# EAGLE design module-pre-amp (EAGLE 7.4.0)
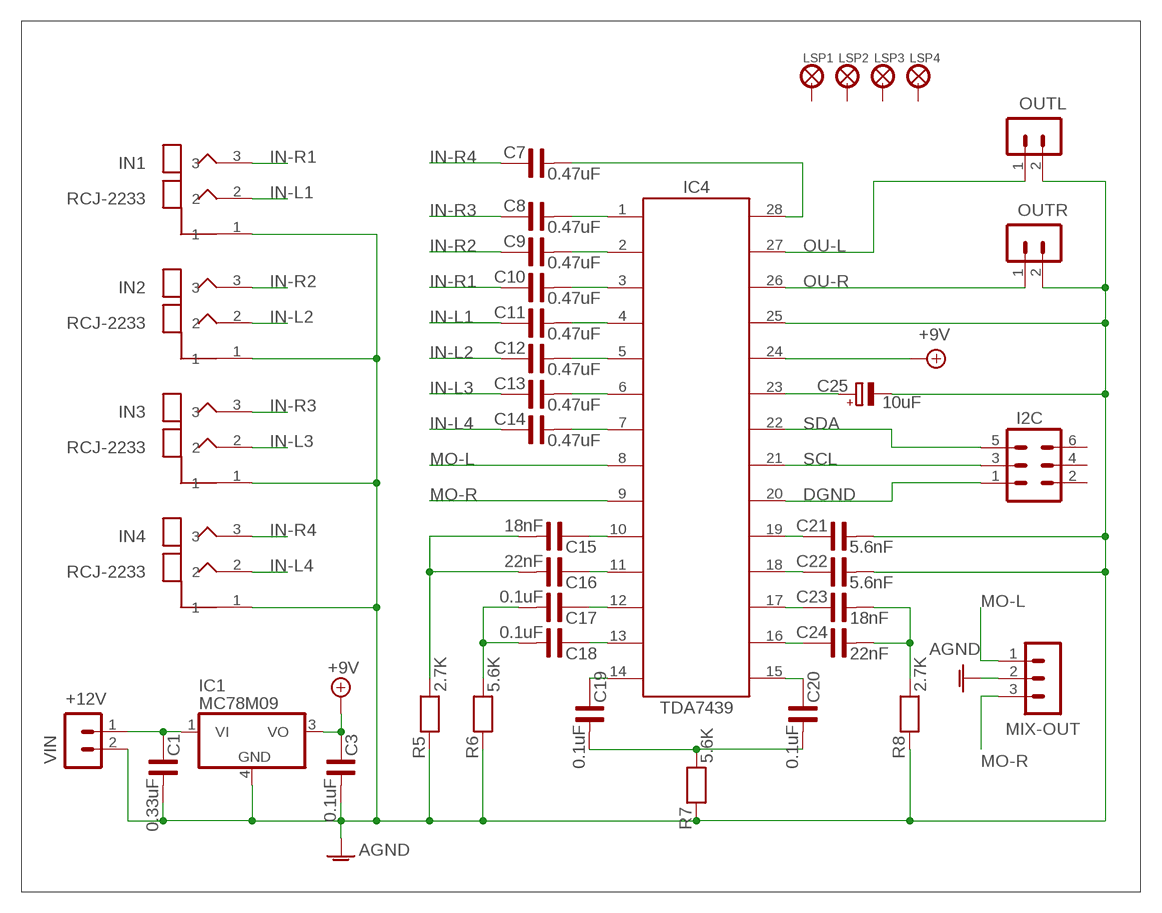
[diagram p0: schematic, sheet 1]

## Parts
C1  0.33uF  C-US1206  [C1206]
C3  0.1uF  C-US1206  [C1206]
C7  0.47uF  C-US0805  [C0805]
C8  0.47uF  C-US0805  [C0805]
C9  0.47uF  C-US0805  [C0805]
C10  0.47uF  C-US0805  [C0805]
C11  0.47uF  C-US0805  [C0805]
C12  0.47uF  C-US0805  [C0805]
C13  0.47uF  C-US0805  [C0805]
C14  0.47uF  C-US0805  [C0805]
C15  18nF  C-US0805  [C0805]
C16  22nF  C-US0805  [C0805]
C17  0.1uF  C-US0805  [C0805]
C18  0.1uF  C-US0805  [C0805]
C19  0.1uF  C-US0805  [C0805]
C20  0.1uF  C-US0805  [C0805]
C21  5.6nF  C-US0805  [C0805]
C22  5.6nF  C-US0805  [C0805]
C23  18nF  C-US0805  [C0805]
C24  22nF  C-US0805  [C0805]
C25  10uF  CPOL-EUE2.5-7  [E2,5-7]
I2C  MA03-2  [MA03-2]
IC1  MC78M09  MC78M09CDTG  [DPACK_3]
IC4  TDA7439  [SO28W]
IN1  RCJ-2233  [RCJ-2233]
IN2  RCJ-2233  [RCJ-2233]
IN3  RCJ-2233  [RCJ-2233]
IN4  RCJ-2233  [RCJ-2233]
LSP1  LSP27  [LSP27]
LSP2  LSP27  [LSP27]
LSP3  LSP27  [LSP27]
LSP4  LSP27  [LSP27]
MIX-OUT  MA03-1PL  [MA03-1]
OUTL  MA02-1GREEN  [MA02-1-GREEN]
OUTR  MA02-1GREEN  [MA02-1-GREEN]
R5  2.7K  R-US0805  [R0805]
R6  5.6K  R-US0805  [R0805]
R7  5.6K  R-US0805  [R0805]
R8  2.7K  R-US0805  [R0805]
VIN  MA02-1GREEN  [MA02-1-GREEN]

## Nets
+12V: C1.1 IC1.1(VI) VIN.1
AGND: C1.2 C3.2 C21.2 C22.2 C25.- IC1.4(GND) IC4.25 IN1.1 IN2.1 IN3.1 IN4.1 MIX-OUT.2 OUTL.2 OUTR.2 R5.1 R6.1 R7.1 R8.1 VIN.2
AVDD: C3.1 IC1.3(VO) IC4.24 ; supply symbol labelled +9V
DGND: I2C.1 IC4.20
IN-L1: C11.1 IN1.2
IN-L2: C12.1 IN2.2
IN-L3: C13.1 IN3.2
IN-L4: C14.1 IN4.2
IN-R1: C10.1 IN1.3
IN-R2: C9.1 IN2.3
IN-R3: C8.1 IN3.3
IN-R4: C7.1 IN4.3
MO-L: IC4.8 MIX-OUT.1
MO-R: IC4.9 MIX-OUT.3
N$1: C25.+ IC4.23
N$3: C8.2 IC4.1
N$4: C13.2 IC4.6
N$5: C14.2 IC4.7
N$6: C12.2 IC4.5
N$7: C11.2 IC4.4
N$8: C10.2 IC4.3
N$9: C9.2 IC4.2
N$11: C22.1 IC4.18
N$13: C21.1 IC4.19
N$24: C15.1 IC4.10
N$25: C16.1 IC4.11
N$26: C7.2 IC4.28
N$27: C15.2 C16.2 R5.2
N$28: C17.1 IC4.12
N$29: C18.1 IC4.13
N$31: C17.2 C18.2 R6.2
N$32: C24.1 IC4.16
N$33: C23.1 IC4.17
N$34: C23.2 C24.2 R8.2
N$35: C19.1 IC4.14
N$36: C20.1 IC4.15
N$39: C19.2 C20.2 R7.2
OU-L: IC4.27 OUTL.1
OU-R: IC4.26 OUTR.1
SCL: I2C.3 IC4.21
SDA: I2C.5 IC4.22
Unconnected: I2C.2 I2C.4 I2C.6 LSP1.MP LSP2.MP LSP3.MP LSP4.MP

## Library data of the parts
C1 C3 = MyComponents:C-US: SMD Multilayer Ceramic Capacitor
C7-C24 = MyComponents:C-US: SMD Multilayer Ceramic Capacitor; MOUSER: 80-C0805C104J5RAUTO
C25 = rcl:CPOL-EU: POLARIZED CAPACITOR, European symbol
I2C = MyComponents:MA03-2: Headers & Wire Housing, 2 Row, 6 Position; MOUSER: 68602-406HLF
IC1 = linear:MC78M: 500 mA Positive Voltage Regulators Source: Data sheet <http://www.onsemi.com/pub_link/Collateral/MC78M00-D.PDF>
IC4 = MyComponents:TDA7439: Three-band digitally-controlled audio processor; MOUSER: 511-TDA7439DS13TR
IN1-IN4 = MyComponents:RCJ-2233: RCA Jack, Dual, Rt Angle, PCB Mount, Vert
LSP1-LSP4 = MyComponents:LSP27: Solder Pad, drill 2.75 mm
MIX-OUT = MyComponents:MA03-1: Headers & Wire Housing, 1 Row, 3 Position
OUTL OUTR VIN = MyComponents:MA02-1: Headers & Wire Housing, 1 Row, 3 Position
R5-R8 = MyComponents:R-US: SMD Resistor; MOUSER: 660-RK73H2ATTDD1R00F

## Board
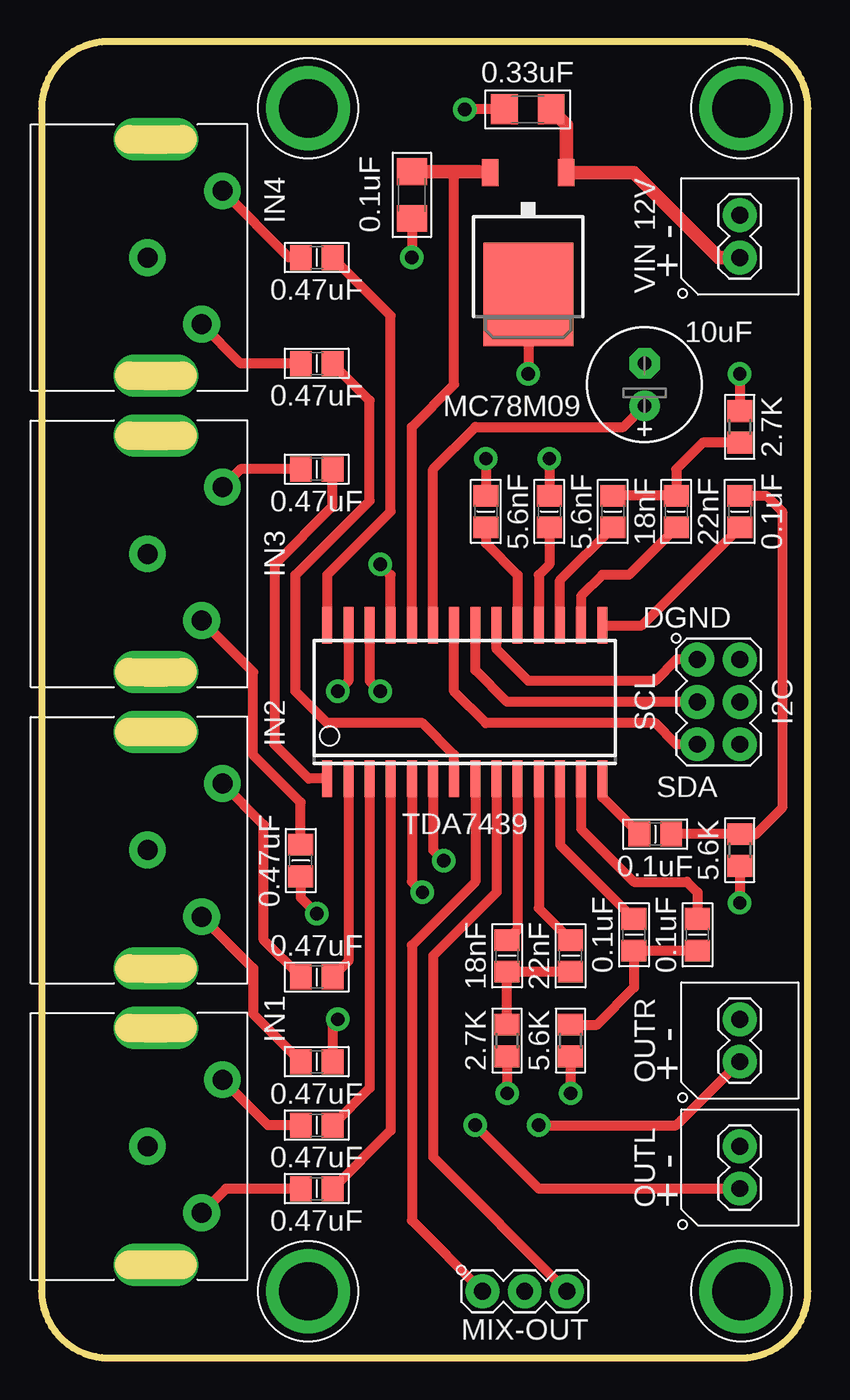
[diagram p1: board, top side]
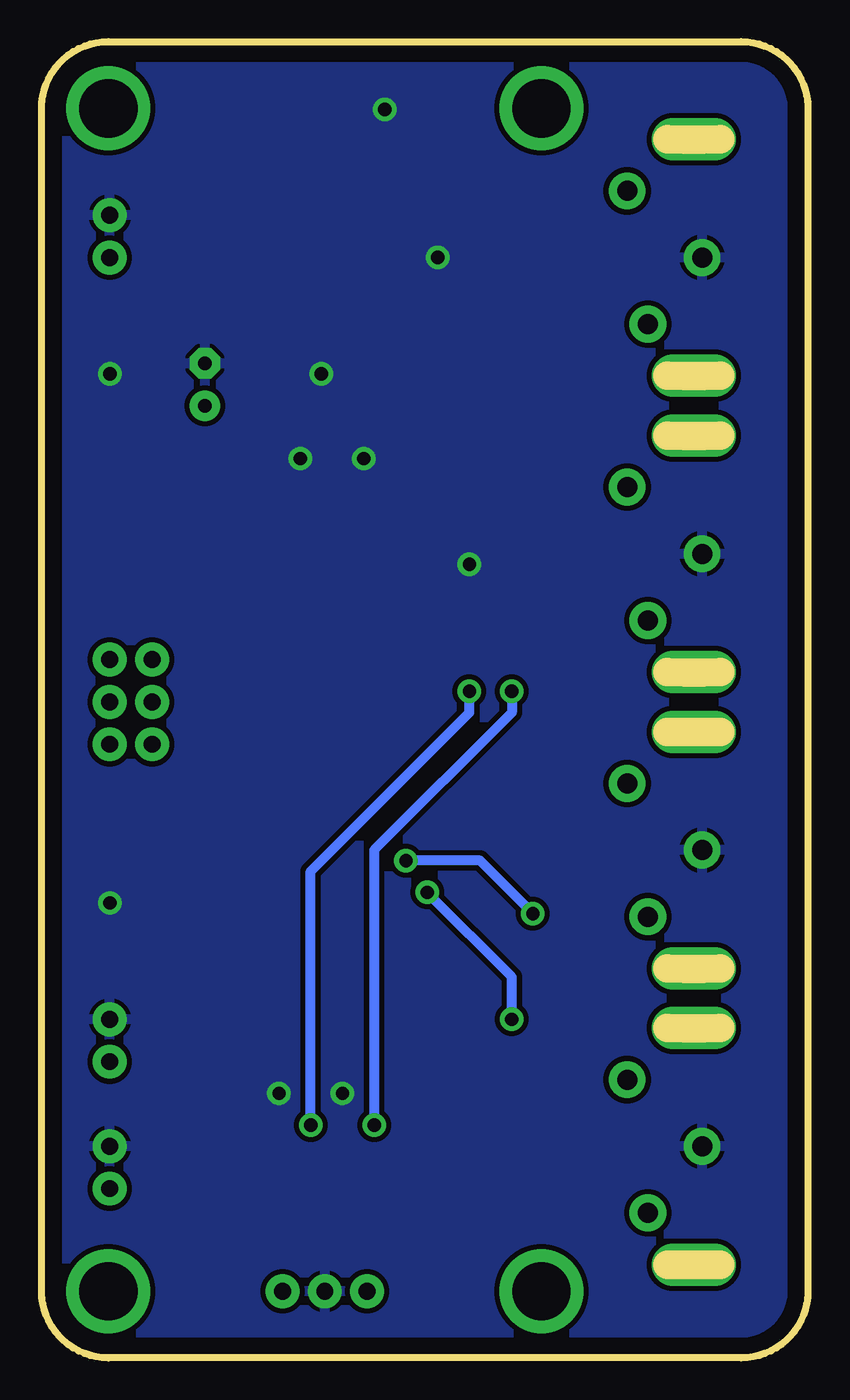
[diagram p2: board, bottom side, seen from below]

Size 46 x 79 mm. Coordinates in mm from the lower left corner, seen from the top.
Outline: 0,4 arc90 4,0 42,0 arc90 46,4 46,75 arc90 42,79 4,79 arc90 0,75 0,4
Copper layers (1*16): Top 0.035mm / dielectric 1.5mm / Bottom 0.035mm
Design rules "analog": minimum track width 20mil, minimum drill 19mil, track to track 12mil, track to pad 12mil, pad to pad 12mil, via to via 12mil, smd to smd 8mil, copper to edge 40mil, drill to drill 40mil, minimum pad ring 20mil, minimum via ring 12mil, stop-mask expansion 1mil, vias tented up to drill 0mil, thermal gap 10mil

### Footprints (pad centres in the part's own frame; a part is rotated, then mirrored left to right if it is on the bottom)
C1206 = smd 1.6 x 1.8: 1 -1.4,0; 2 1.4,0
C0805 = smd 1.3 x 1.5: 1 -0.95,0; 2 0.95,0
E2,5-7 = drill 0.813 pad 1.6: + -1.27,0 | drill 0.813 pad 1.6 octagon: - 1.27,0
MA03-2 = drill 1.016: 1 -2.54,-1.27; 2 -2.54,1.27; 3 0,-1.27; 4 0,1.27; 5 2.54,-1.27; 6 2.54,1.27
DPACK_3 = smd 1 x 1.6: 1 -2.28,-4.8; 3 2.28,-4.8 | smd 5.4 x 6.2: 4 0,2.5
SO28W = smd 0.6 x 2.2: 1 -8.255,-4.6; 2 -6.985,-4.6; 3 -5.715,-4.6; 4 -4.445,-4.6; 5 -3.175,-4.6; 6 -1.905,-4.6; 7 -0.635,-4.6; 8 0.635,-4.6; 9 1.905,-4.6; 10 3.175,-4.6; 11 4.445,-4.6; 12 5.715,-4.6; 13 6.985,-4.6; 14 8.255,-4.6; 15 8.255,4.6; 16 6.985,4.6; 17 5.715,4.6; 18 4.445,4.6; 19 3.175,4.6; 20 1.905,4.6; 21 0.635,4.6; 22 -0.635,4.6; 23 -1.905,4.6; 24 -3.175,4.6; 25 -4.445,4.6; 26 -5.715,4.6; 27 -6.985,4.6; 28 -8.255,4.6
RCJ-2233 = drill 1.2 pad 2.184: 1 0,0; 2 -4,-3.25; 3 4,-4.5 | drill 1.1 pad 2.54 long: M1 -7.1,-0.5; M2 7.1,-0.5
LSP27 = drill 3.5 pad 5: MP 0,0
MA03-1 = drill 1.016: 1 -2.54,0; 2 0,0; 3 2.54,0
MA02-1-GREEN = drill 1.016: 1 -1.27,0; 2 1.27,0
R0805 = smd 1.3 x 1.5: 1 -0.95,0; 2 0.95,0

### Placement (x,y rotation side)
C1  29.18,74.93 180 top
C3  22.23,69.8 270 top
C7  16.51,66.04 0 top
C8  16.51,53.34 0 top
C9  16.51,22.86 0 top
C10  16.51,13.97 0 top
C11  16.51,10.16 0 top
C12  16.51,17.78 0 top
C13  15.56,29.84 270 top
C14  16.51,59.69 0 top
C15  27.94,24.13 270 top
C16  31.75,24.13 270 top
C17  35.56,25.4 270 top
C18  39.37,25.4 270 top
C19  36.83,31.43 0 top
C20  41.91,50.8 90 top
C21  26.67,50.8 90 top
C22  30.48,50.8 90 top
C23  34.29,50.8 90 top
C24  38.1,50.8 90 top
C25  36.2,58.42 90 top
I2C  40.64,39.37 270 top
IC1  29.21,66.33 180 top
IC4  25.4,39.37 0 top
IN1  6.35,12.7 90 top
IN2  6.35,30.48 90 top
IN3  6.35,48.26 90 top
IN4  6.35,66.04 90 top
LSP1  16,75 0 top
LSP2  42,75 0 top
LSP3  16,4 0 top
LSP4  42,4 0 top
MIX-OUT  29,4 0 top
OUTL  41.91,11.43 90 top
OUTR  41.91,19.05 90 top
R5  27.94,19.05 90 top
R6  31.75,19.05 90 top
R7  41.91,30.48 90 top
R8  41.91,55.88 270 top
VIN  41.91,67.31 90 top

### Tracks (layer width: path | path; a pad name or v marks a point on that pad's centre or on a via)
+12V
  Top 0.813: VIN.1 40.64,66.04 35.55,71.13 IC1.1 31.49,74.03 C1.1
AGND  (via drill 0.8)
  Top 0.61: C3.2 v22.23,66.04 | IC1.4 v29.21,59.05 | C1.2 v25.4,74.93 | v41.91,59.05 R8.1 | v30.48,53.98 C22.2 | v26.67,53.98 C21.2 | IC4.25 20.95,46.99 v20.32,47.62 | R7.1 v41.91,27.3 | R5.1 v27.94,15.88 | R6.1 v31.75,15.88
  pour Bottom (rank 4): 0,0 46,0 46,79 0,79
AVDD
  Top 0.61: IC4.24 22.23,55.88 24.77,58.42 24.77,71.2
  Top 0.813: IC1.3 26.23,71.2 24.77,71.2 C3.1
DGND
  Top 0.61: I2C.1 38.1,41.91 36.83,40.64 29.21,40.64 27.3,42.55 IC4.20
IN-L1
  Top 0.61: C11.1 11.06,10.16 IN1.2
IN-L2
  Top 0.61: IN2.2 12.7,23.38 12.7,20.64 C12.1
IN-L3
  Top 0.61: C13.1 15.56,33.34 12.7,36.2 12.7,41.16 IN3.2
IN-L4
  Top 0.61: C14.1 11.95,59.69 IN4.2
IN-R1
  Top 0.61: C10.1 13.58,13.97 IN1.3
IN-R2
  Top 0.61: C9.1 13.34,25.09 13.34,32 IN2.3
IN-R3
  Top 0.61: C8.1 11.93,53.34 IN3.3
IN-R4
  Top 0.61: C7.1 14.85,66.04 IN4.3
MO-L
  Top 0.61: IC4.8 26.04,28.57 22.23,24.77 22.23,8.26 MIX-OUT.1
MO-R
  Top 0.61: IC4.9 27.3,27.94 23.5,24.13 23.5,12.06 MIX-OUT.3
N$1
  Top 0.61: IC4.23 23.5,53.34 26.04,55.88 34.92,55.88 C25.+
N$3
  Top 0.61: IC4.1 16.03,34.77 13.97,36.83 13.97,47.62 17.46,51.12 C8.2
N$4  (via drill 0.8)
  Top 0.61: C13.2 15.56,27.62 v16.51,26.67 | IC4.6 23.5,30.48 v24.13,29.84
  Bottom 0.61: v16.51,26.67 19.68,29.84 v24.13,29.84
N$5
  Top 0.61: IC4.7 24.77,36.2 22.86,38.1 17.14,38.1 15.24,40.01 15.24,46.99 19.68,51.44 19.68,57.47 C14.2
N$6  (via drill 0.8)
  Top 0.61: v17.78,20.32 17.46,20 C12.2 | IC4.5 22.23,28.57 v22.86,27.94
  Bottom 0.61: v17.78,20.32 17.78,22.86 v22.86,27.94
N$7
  Top 0.61: IC4.4 20.95,13.65 C11.2
N$8
  Top 0.61: IC4.3 19.68,16.2 C10.2
N$9
  Top 0.61: IC4.2 18.41,23.82 C9.2
N$11
  Top 0.61: C22.1 30.48,47.62 29.84,46.99 IC4.18
N$13
  Top 0.61: C21.1 26.67,48.9 28.57,46.99 IC4.19
N$24
  Top 0.61: IC4.10 28.57,25.71 C15.1
N$25
  Top 0.61: IC4.11 29.84,26.98 C16.1
N$26
  Top 0.61: IC4.28 17.14,46.99 20.95,50.8 20.95,62.55 C7.2
N$27
  Top 0.61: C16.2 C15.2 R5.2
N$28
  Top 0.61: IC4.12 31.11,30.8 C17.1
N$29
  Top 0.61: IC4.13 32.38,31.75 35.56,28.57 38.73,28.57 39.37,27.94 C18.1
N$31
  Top 0.61: C18.2 C17.2 35.56,22.23 33.34,20 R6.2
N$32
  Top 0.61: C24.1 35.24,46.99 33.66,46.99 32.38,45.72 IC4.16
N$33
  Top 0.61: IC4.17 31.11,46.67 C23.1
N$34
  Top 0.61: R8.2 39.69,54.93 38.1,53.34 C24.2 C23.2
N$35
  Top 0.61: IC4.14 33.66,33.66 C19.1
N$36
  Top 0.61: IC4.15 36.03,43.97 C20.1
N$39
  Top 0.61: C19.2 R7.2 42.86,31.43 44.45,33.02 44.45,50.8 43.5,51.75 C20.2
OU-L  (via drill 0.8)
  Top 0.61: IC4.27 18.41,40.64 v17.78,40.01 | OUTL.1 29.84,10.16 v26.04,13.97
  Bottom 0.61: v17.78,40.01 17.78,38.73 26.04,30.48 v26.04,13.97
OU-R  (via drill 0.8)
  Top 0.61: IC4.26 19.68,40.64 v20.32,40.01 | v29.84,13.97 38.1,13.97 OUTR.1
  Bottom 0.61: v29.84,13.97 29.84,29.21 20.32,38.73 v20.32,40.01
SCL
  Top 0.61: I2C.3 27.94,39.37 26.04,41.27 IC4.21
SDA
  Top 0.61: I2C.5 38.1,36.83 36.83,38.1 26.67,38.1 24.77,40.01 IC4.22

### Text on the board
tPlace: + - | + - | + -
tNames: IN4 | 12V | IN3 | DGND | SCL | IN2 | SDA | IN1